# EAGLE design LowerBoard_r1 (EAGLE 7.0.0)
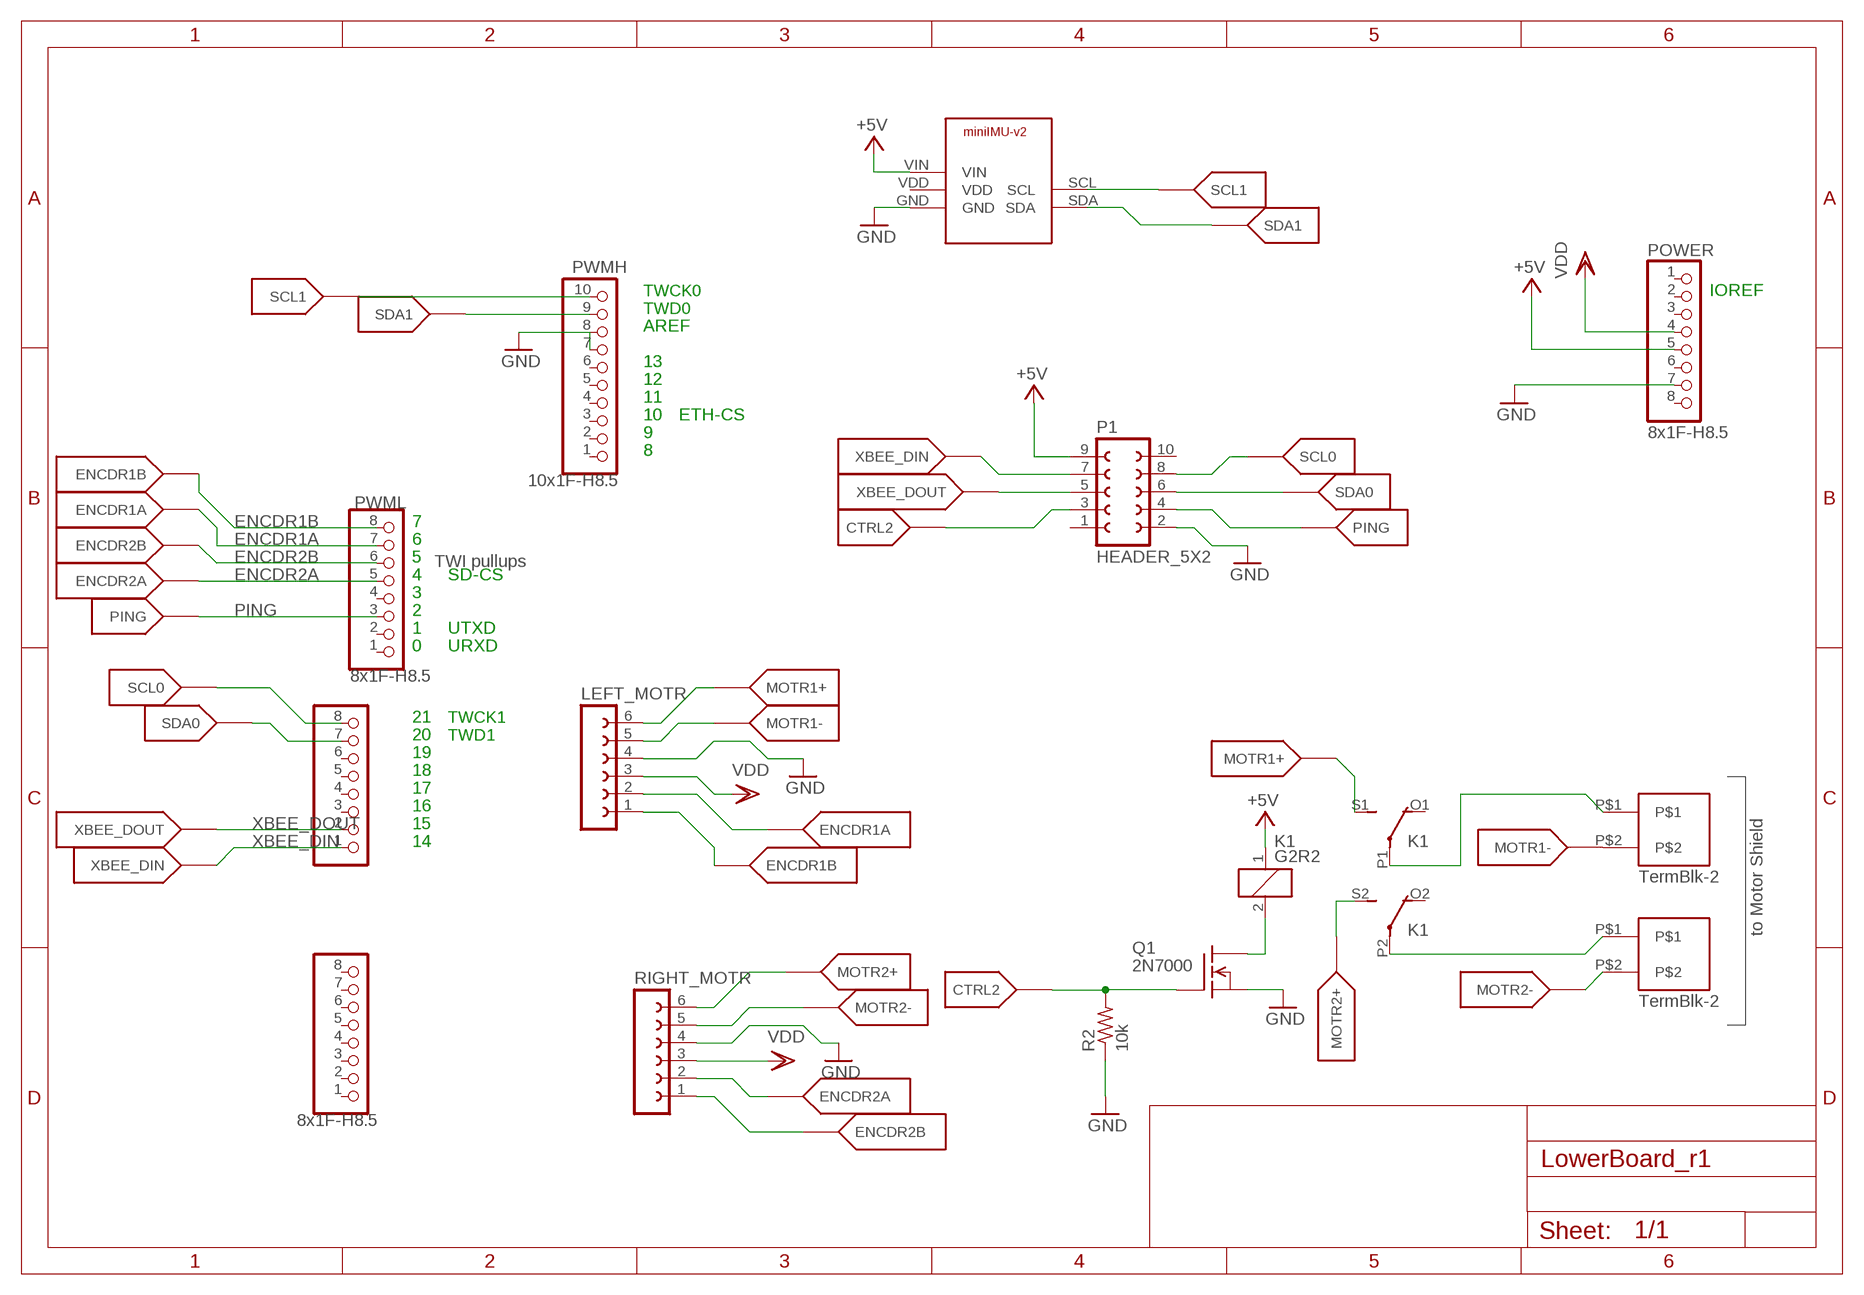
[diagram p0: schematic, sheet 1]

## Parts
ANALOG  8x1F-H8.5  PINHD-1X8  [1X08]
COMMS  PINHD-1X8  [1X08]
K1  G2R2  [G2R2]
LEFT_MOTR  FE06-1  [FE06]
P1  HEADER_5X2  [HEADER_5X2]
POWER  8x1F-H8.5  PINHD-1X8  [1X08]
PWMH  10x1F-H8.5  PINHD-1X10  [1X10]
PWML  8x1F-H8.5  PINHD-1X8  [1X08]
Q1  2N7000  [TO92]
R2  10k  RESISTOR  [RESISTOR_PKG]
RIGHT_MOTR  FE06-1  [FE06]
U$5  POLOLU_MINIIMU9_V2  [POLOLU_IMU9V2]
U$11  motor1  TB2  [TB2_PKG]
U$12  TB2  [TB2_PKG]

## Nets
+5V: K1.1 P1.9 POWER.5 U$5.VIN
CTRL2: P1.3 Q1.G R2.2
ENCDR1A: LEFT_MOTR.2 PWML.7
ENCDR1B: LEFT_MOTR.1 PWML.8
ENCDR2A: PWML.5 RIGHT_MOTR.2
ENCDR2B: PWML.6 RIGHT_MOTR.1
GND: LEFT_MOTR.4 P1.2 POWER.7 PWMH.7 Q1.S R2.1 RIGHT_MOTR.4 U$5.GND
MOTR1+: K1.S1(2:S) LEFT_MOTR.6
MOTR1-: LEFT_MOTR.5 U$11.P$2
MOTR2+: K1.S2(3:S) RIGHT_MOTR.6
MOTR2-: RIGHT_MOTR.5 U$12.P$2
N$3: K1.P1(2:P) U$11.P$1
N$4: K1.P2(3:P) U$12.P$1
N$6: K1.2 Q1.D
PING: P1.4 PWML.3
SCL: PWMH.10 U$5.SCL ; supply symbol labelled SCL1
SCL0: COMMS.8 P1.8
SDA: PWMH.9 U$5.SDA ; supply symbol labelled SDA1
SDA0: COMMS.7 P1.6
VDD: LEFT_MOTR.3 POWER.4 RIGHT_MOTR.3
XBEE_DIN: COMMS.1 P1.7
XBEE_DOUT: COMMS.2 P1.5
Unconnected: ANALOG.1 ANALOG.2 ANALOG.3 ANALOG.4 ANALOG.5 ANALOG.6 ANALOG.7 ANALOG.8 COMMS.3 COMMS.4 COMMS.5 COMMS.6 K1.O1(2:O) K1.O2(3:O) P1.1 P1.10 POWER.1 POWER.2 POWER.3 POWER.6 POWER.8 PWMH.1 PWMH.2 PWMH.3 PWMH.4 PWMH.5 PWMH.6 PWMH.8 PWML.1 PWML.2 PWML.4 U$5.VDD

## Notes on the sheet
- TWCK0 | IOREF
- TWD0
- AREF
- 13
- 12
- 11
- 10 | ETH-CS
- 9
- 8
- 7
- 6
- 5 | TWI pullups
- 4 | SD-CS
- 3
- 2
- 1 | UTXD
- 0 | URXD
- 21 | TWCK1
- 20 | TWD1
- 19
- 18
- 17
- 16
- 15
- 14
- to Motor Shield

## Library data of the parts
ANALOG COMMS POWER PWML = LowerBoard_r1:PINHD-1X8: PIN HEADER
K1 = myDevices:G2R2: RELAY 2 x switch, Omron; MF: OMRON COMPONENTS USA; MPN: G2R-2-DC6; OC_FARNELL: unknown; OC_NEWARK: 89C5317
LEFT_MOTR RIGHT_MOTR = LowerBoard_r1:FE06-1: FEMALE HEADER; OC_FARNELL: unknown; OC_NEWARK: unknown
P1 = LowerBoard_r1:HEADER_5X2
PWMH = LowerBoard_r1:PINHD-1X10: PIN HEADER
Q1 = myDevices:2N7000: N-Channel Enhancement Mode FET Fairchild 2N7000
R2 = myDevices:RESISTOR: 1/4 Watt Resistor
U$5 = LowerBoard_r1:POLOLU_MINIIMU9_V2: Pololu miniIMU-9 v2
U$11 U$12 = LowerBoard_r1:TB2: Terminal Block with 2 connections

## Net classes
0 default: width 0.203 mm, drill 0.406 mm, clearance 0.203 mm
1 USB: width 0.203 mm, drill 0.406 mm, clearance 0.203 mm
2 gnd: width 0.203 mm, drill 0.406 mm, clearance 0.203 mm
3 usbvcc: width 0.203 mm, drill 0.406 mm, clearance 0.203 mm
4 USBpair: width 0.254 mm, drill 0.406 mm, clearance 0.61 mm

## Board
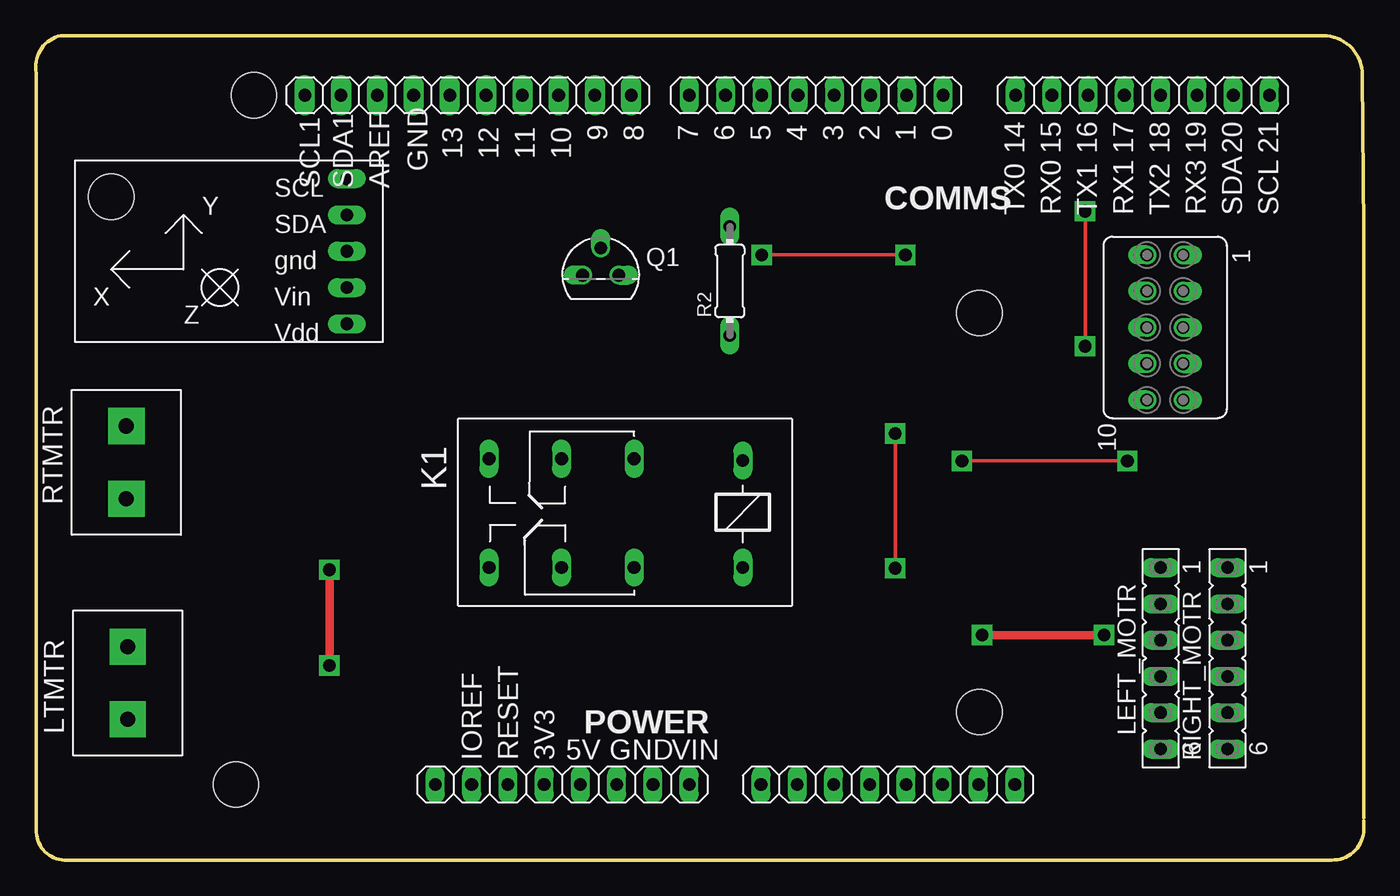
[diagram p1: board, top side]
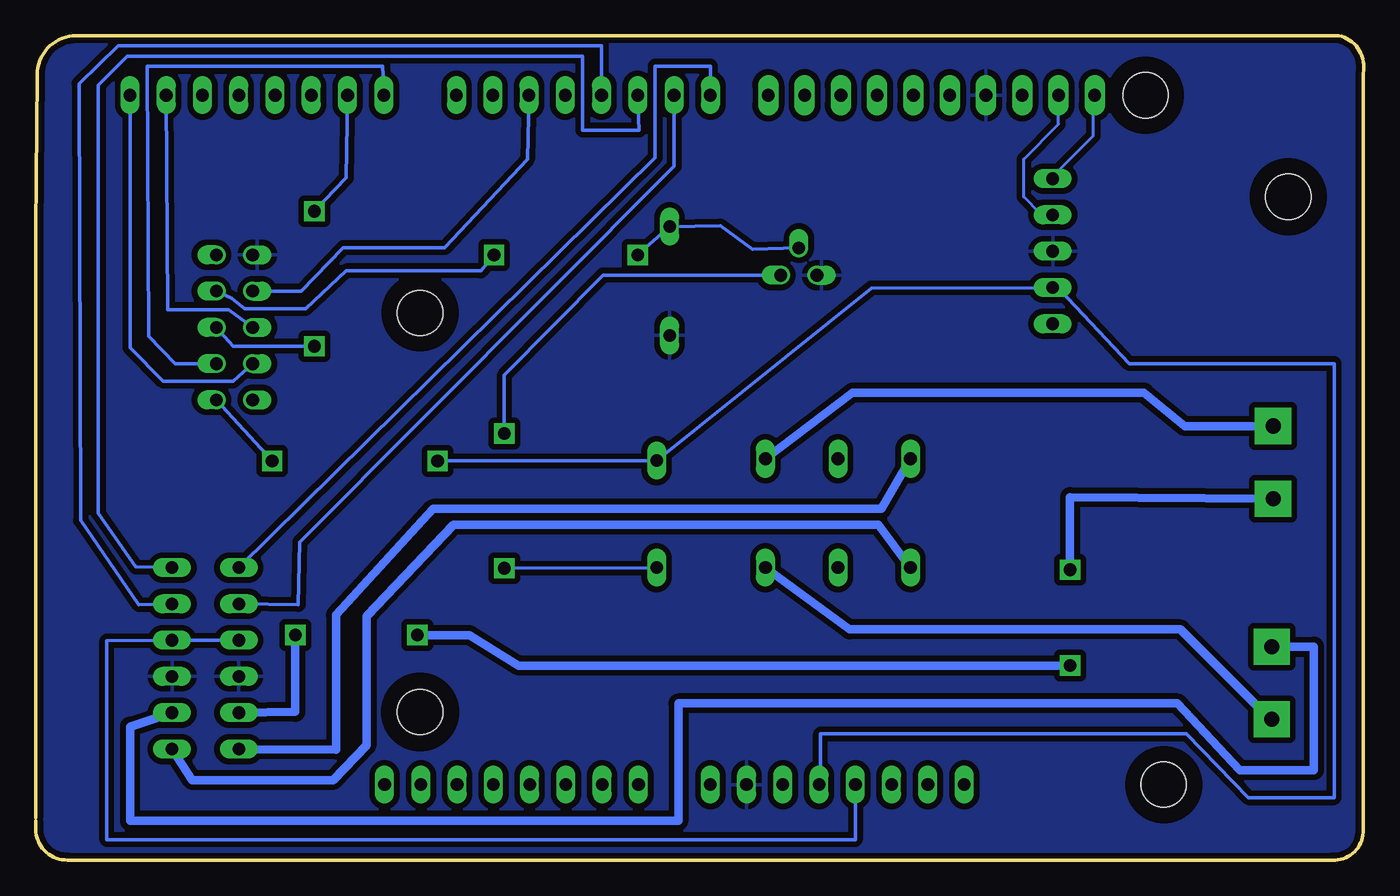
[diagram p2: board, bottom side, seen from below]

Size 93.01 x 57.71 mm. Coordinates in mm from the lower left corner, seen from the top.
Outline: 93.01,2.95 93.01,44.15 92.91,54.86
Outline: 93.01,2.74 93.01,2.13 arc-90 90.78,0 2.18,0 arc-90 0.05,1.93 0.05,55.08 arc-90 1.76,57.71 90.17,57.71 arc-90 92.91,54.97
Copper layers (1*16): Top 0.035mm / dielectric 1.6mm / Bottom 0.035mm
Design rules "DAZL": minimum track width 0.2mm, minimum drill 35mil, track to track 0.401mm, track to pad 0.401mm, pad to pad 0.401mm, via to via 0.401mm, smd to smd 6mil, copper to edge 0.404mm, drill to drill 1mm, minimum pad ring 0.2mm, minimum via ring 0.2mm, stop-mask expansion 2mil, vias tented up to drill 25mil, thermal gap 16mil
Holes 3.17 mm at 15.29,53.54 14.02,5.28 66.09,38.3 66.09,10.36
tRestrict: area 63.5,7.8 to 68.6,12.9; area 12.7,51 to 17.8,56.1; area 63.5,35.8 to 68.6,40.8; area 11.5,2.7 to 16.6,7.8
bRestrict: area 63.5,7.8 to 68.6,12.9; area 12.7,51 to 17.8,56.1; area 63.5,35.8 to 68.6,40.8; area 11.5,2.7 to 16.6,7.8

### Footprints (pad centres in the part's own frame; a part is rotated, then mirrored left to right if it is on the bottom)
1X08 = drill 0.889 pad 1.27 long: 1 -8.89,0; 2 -6.35,0; 3 -3.81,0; 4 -1.27,0; 5 1.27,0; 6 3.81,0; 7 6.35,0; 8 8.89,0
G2R2 = drill 0.889 long: 1 -2.54,-3.683; 2 -2.54,3.81; O1 10.16,-3.81; O2 10.16,3.81; P1 5.08,-3.81; P2 5.08,3.81; S1 15.24,-3.81; S2 15.24,3.81
FE06 = drill 0.889 long: 1 -6.35,0; 2 -3.81,0; 3 -1.27,0; 4 1.27,0; 5 3.81,0; 6 6.35,0
HEADER_5X2 = drill 0.889 pad 1.27 offset: 1 -5.08,1.27; 2 -5.08,-1.27; 3 -2.54,1.27; 4 -2.54,-1.27; 5 0,1.27; 6 0,-1.27; 7 2.54,1.27; 8 2.54,-1.27; 9 5.08,1.27; 10 5.08,-1.27
1X10 = drill 0.889 pad 1.422 long: 1 -11.43,0; 2 -8.89,0; 3 -6.35,0; 4 -3.81,0; 5 -1.27,0; 6 1.27,0; 7 3.81,0; 8 6.35,0; 9 8.89,0; 10 11.43,0
TO92 = drill 0.889 offset: D 1.27,0; G 0,1.905; S -1.27,0
RESISTOR_PKG = drill 0.889 long: 1 -3.81,0; 2 3.81,0
POLOLU_IMU9V2 = drill 0.889 long: GND 5.08,-1.27; SCL 5.08,3.81; SDA 5.08,1.27; VDD 5.08,-6.35; VIN 5.08,-3.81 | hole 3.175: -11.43,2.54
TB2_PKG = drill 1.067 pad 2.54 square: P$1 0,2.54; P$2 0,-2.54

### Placement (x,y rotation side)
ANALOG  59.69,5.28 0 top
COMMS  77.52,53.54 0 top
DRILEGEND  [DRILEGEND]  -0.38,-3.94 0 top  (outside the outline)
K1  46.99,24.28 180 top
LEFT_MOTR  78.79,14.12 270 top
P1  79.09,37.29 270 top
POWER  36.88,5.28 0 top
PWMH  30.27,53.54 180 top
PWML  54.66,53.54 180 top
Q1  39.57,40.95 0 top
R2  48.61,40.54 90 top
RIGHT_MOTR  83.46,14.12 270 top
U$5  16.71,43.89 0 top
U$11  6.35,27.84 0 top
U$12  6.45,12.4 180 top

### Tracks (layer width: path | path; a pad name or v marks a point on that pad's centre or on a via)
+5V  (via drill 0.89)
  Top 0.254: v76.45,27.94 v64.87,27.94
  Bottom 0.203: 38.05,5.39 POWER.5
  Bottom 0.254: P1.9 v76.45,27.94 | v64.87,27.94 K1.1 34.49,40.03 U$5.VIN 21.28,39.93 16.41,34.75 2.08,34.75 2.08,4.37 8.07,4.37 12.44,8.84 38.05,8.84 38.05,5.39
CTRL2  (via drill 0.89)
  Top 0.254: v50.85,42.37 v60.91,42.37
  Bottom 0.254: Q1.G 42.82,42.77 45.06,44.4 R2.2 v50.85,42.37 | v60.91,42.37 61.82,41.25 71.27,41.25 74.11,38.61 78.38,38.61 79.3,39.32 P1.3
ENCDR1A
  Bottom 0.254: PWML.7 48.31,48.57 74.52,22.25 74.62,17.88 LEFT_MOTR.2
ENCDR1B
  Bottom 0.254: PWML.8 45.77,55.58 49.63,55.58 49.63,49.17 LEFT_MOTR.1
ENCDR2A
  Bottom 0.254: PWML.5 53.39,57 87.22,57 89.96,54.36 89.86,23.77 85.8,17.88 RIGHT_MOTR.2
ENCDR2B
  Bottom 0.254: PWML.6 50.75,51.11 54.71,51.11 54.71,56.29 86.61,56.29 88.64,54.25 88.64,24.28 86,20.52 RIGHT_MOTR.1
GND
  pour Bottom: 94.84,57.3 2.08,57.3 arc90 -0.26,55.07 -0.87,-0.51 93.93,-0.2
MOTR1+
  Bottom 0.61: K1.S1 33.78,24.59 65.17,24.59 71.98,17.17 71.98,7.72 LEFT_MOTR.6
MOTR1-  (via drill 0.89)
  Top 0.61: v20.57,20.32 v20.57,13.61 | v66.29,15.75 v74.83,15.75
  Bottom 0.203: 78.69,10.47 LEFT_MOTR.5
  Bottom 0.61: v20.57,13.61 59.18,13.61 62.63,15.75 v66.29,15.75 | v74.83,15.75 74.83,10.36 LEFT_MOTR.5 | U$11.P$2 20.57,25.4 v20.57,20.32
MOTR2+
  Bottom 0.61: K1.S2 33.98,23.47 63.75,23.47 69.85,17.07 69.85,8.03 72.18,5.59 82.04,5.59 RIGHT_MOTR.6
MOTR2-
  Bottom 0.61: U$12.P$2 3.5,14.94 3.5,6.3 8.68,6.3 13.05,10.97 48,10.97 48,2.74 86.41,2.74 86.41,9.35 RIGHT_MOTR.5
N$3
  Bottom 0.61: U$11.P$1 12.54,30.38 15.39,32.72 35.81,32.72 K1.P1
N$4
  Bottom 0.203: 6.55,9.86 U$12.P$1
  Bottom 0.61: 6.55,9.86 12.85,16.15 36.01,16.15 K1.P2
N$6  (via drill 0.89)
  Top 0.254: v60.19,29.87 v60.19,20.42
  Bottom 0.254: Q1.D 53.29,40.95 60.19,33.93 v60.19,29.87 | v60.19,20.42 K1.2
PING
  Bottom 0.254: PWML.3 58.57,49.07 64.36,42.88 71.47,42.88 74.42,39.83 P1.4
SCL
  Bottom 0.203: PWMH.10 18.95,53.54 18.95,50.7 21.79,47.85 U$5.SCL
SCL0
  Bottom 0.254: P1.8 79.19,33.53 84.07,33.53 86.41,35.87 COMMS.8
SDA
  Bottom 0.203: PWMH.9 21.38,51.51 23.82,49.07 23.82,46.43 22.6,45.21 21.79,45.21 U$5.SDA
SDA0
  Bottom 0.254: P1.6 79.5,38.51 83.77,38.51 COMMS.7
VDD
  Bottom 0.254: LEFT_MOTR.3 RIGHT_MOTR.3 88.03,15.34 88.03,1.42 35.61,1.42 POWER.4
XBEE_DIN
  Bottom 0.254: P1.7 83.26,34.75 85.09,36.68 85.19,55.58 68.73,55.58 COMMS.1
XBEE_DOUT  (via drill 0.89)
  Top 0.254: v73.5,45.42 v73.5,35.97
  Bottom 0.254: COMMS.2 71.27,47.75 v73.5,45.42 | v73.5,35.97 79.19,35.97 P1.5

### Text on the board
tPlace: 9 | 8 | 7 | 6 | 5 | 4 | 3 | 2 | 1 | 0 | 14 | 15 | 16 | 17 | 18 | 19 | 20 | 21 | 13 | 12 | 11 | 10
tNames: GND | SCL1 | SDA1 | AREF | TX0 | RX0 | TX1 | RX1 | TX2 | RX3 | SDA | SCL | RTMTR | LTMTR | IOREF | RESET | 3V3 | 5V | GND | VIN
DrillLegend: LAYER-STACK
DrillLegend_01-16: 01-16
DrillLegend_01-20: 01-20